# EAGLE design JDM2_2-Voltage_JmpConf_6Pin_New (EAGLE 7.2.0)
JDM2 with selectable Dual-Voltage
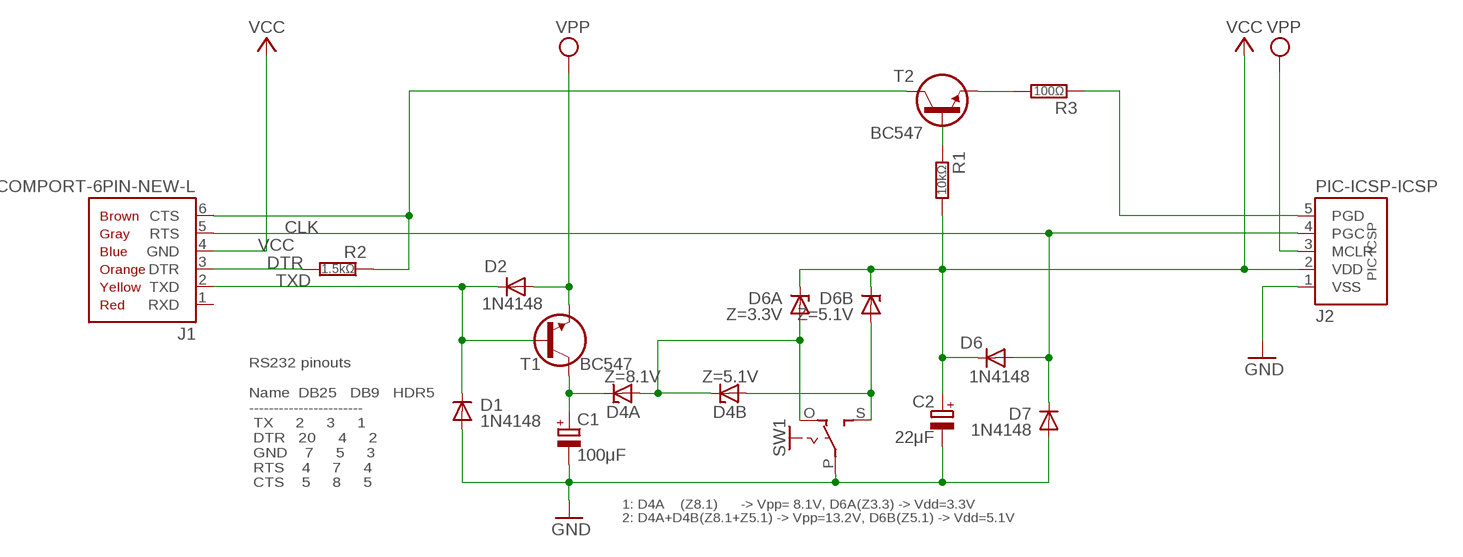
[diagram p0: schematic, sheet 1]

## Parts
C1  100μF  CPOLE2,5-5/V  [E2,5-5/V]
C2  22μF  CPOLE2,5-4/V  [E2.5-4/V]
D1  1N4148  1N414834-5V  [DO34-5V]
D2  1N4148  1N414834-5  [DO34-5]
D4A  Z=8.1V  Z-DIODE34Z5  [DO34Z5]
D4B  Z=5.1V  Z-DIODE34Z5  [DO34Z5]
D6  1N4148  1N414834-5V  [DO34-5V]
D6A  Z=3.3V  Z-DIODE34Z7V  [DO34Z7V]
D6B  Z=5.1V  Z-DIODE34Z7V  [DO34Z7V]
D7  1N4148  1N414834-7V  [DO34-7V]
J1  COMPORT-6PIN-NEW-L  [RS232-6PIN-NEW-L]
J2  PIC-ICSP-ICSP  [PIC-ICSP]
R1  10kΩ  R0202/7-V  [0202/7-V]
R2  1.5kΩ  R0202/7-V  [0202/7-V]
R3  100Ω  R0202/7  [0202/7]
SW1  SL-SW-1P-2T-JPSW  [JPSW-1P2T]
T1  BC547  BC547CBE  [TO92-CBE]
T2  BC547  BC547CBE  [TO92-CBE]

## Nets
/MCLR: D2.A J2.3(MCLR) T1.E ; supply symbol labelled VPP
CLK: D6.A D7.C J1.5(RTS) J2.4(PGC)
CTS: J1.6(CTS) R2.1 T2.C
DATA: R3.2 T2.E
DTR: J1.3(DTR) R2.2
GND: C1.- C2.- D1.A D7.A J2.1(VSS) SW1.P
N$1: R1.1 T2.B
N$3: D4B.A D6B.A SW1.S
N$4: D4A.A D4B.C D6A.A SW1.O
PGD: J2.5(PGD) R3.1
TXD: D1.C D2.C J1.2(TXD) T1.B
VCC: C2.+ D6.C D6A.C D6B.C J1.4(GND) J2.2(VDD) R1.2
VPP: C1.+ D4A.C T1.C
Unconnected: J1.1(RXD)

## Notes on the sheet
- RS232 pinouts
  
  Name  DB25   DB9   HDR5
  -----------------------
   TX     2     3     1
   DTR   20     4     2
   GND    7     5     3
   RTS    4     7     4
   CTS    5     8     5
- 1: D4A    (Z8.1)      -> Vpp= 8.1V, D6A(Z3.3) -> Vdd=3.3V
  2: D4A+D4B(Z8.1+Z5.1) -> Vpp=13.2V, D6B(Z5.1) -> Vdd=5.1V

## Library data of the parts
C1 C2 = c:CPOL: POLARIZED CAPACITOR, European symbol
D1 D2 D6 D7 = d:1N4148
D4A D4B D6A D6B = d:Z-DIODE
J1 = pinconn:COMPORT-6PIN-NEW
J2 = pinconn:PIC-ICSP
R1-R3 = r:R: RESISTOR, European symbol
SW1 = sw:SL-SW-1P-2T
T1 T2 = t:BC547

## Net classes
0 default: width 0.559 mm
1 power: width 0.559 mm

## Board
JDM2 with selectable Dual-Voltage
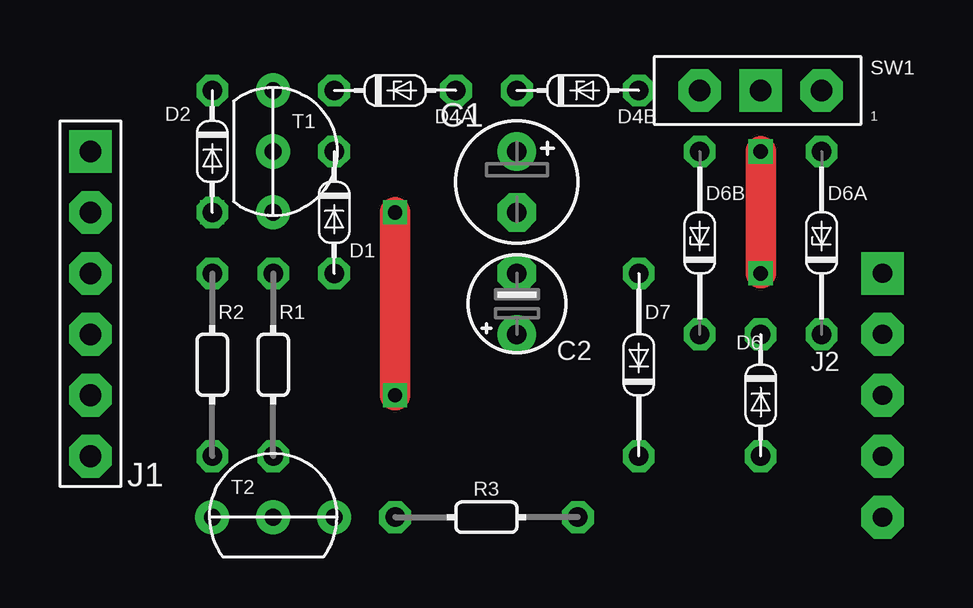
[diagram p1: board, top side]
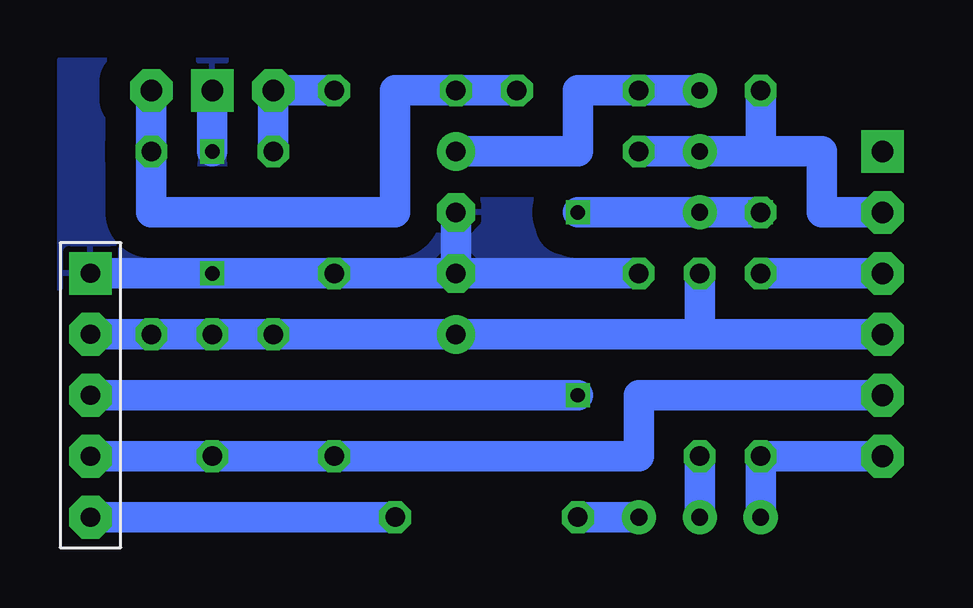
[diagram p2: board, bottom side, seen from below]

No outline drawn. Coordinates in mm, seen from the top.
Copper layers (1*16): Top 0.035mm / dielectric 1.5mm / Bottom 0.035mm
Design rules "default": minimum track width 10mil, minimum drill 24mil, track to track 8mil, track to pad 8mil, pad to pad 8mil, via to via 8mil, smd to smd 8mil, copper to edge 40mil, drill to drill 8mil, minimum pad ring 10mil, minimum via ring 8mil, stop-mask expansion 4mil, vias tented up to drill 0mil, thermal gap 10mil

### Footprints (pad centres in the part's own frame; a part is rotated, then mirrored left to right if it is on the bottom)
E2,5-5/V = drill 0.813 pad 1.6: + 0,2.54 | drill 0.813 pad 1.6 octagon: - 0,0
E2.5-4/V = drill 0.813 pad 1.6: + 0,2.54 | drill 0.813 pad 1.6 octagon: - 0,0
DO34-5V = drill 0.813 octagon: A 0,2.54; C 0,-2.54
DO34-5 = drill 0.813 octagon: A 2.54,0; C -2.54,0
DO34Z5 = drill 0.813 octagon: A -2.54,0; C 2.54,0
DO34Z7V = drill 0.813 octagon: A 0,3.81; C 0,-3.81
DO34-7V = drill 0.813 octagon: A 0,3.81; C 0,-3.81
RS232-6PIN-NEW-L = drill 0.9 pad 1.778 square: 1 0,6.35 | drill 0.9 pad 1.778 octagon: 2 0,3.81; 3 0,1.27; 4 0,-1.27; 5 0,-3.81; 6 0,-6.35
PIC-ICSP = drill 0.8 pad 1.778 square: 1 0,0 | drill 0.8 pad 1.778 octagon: 2 2.54,0; 3 5.08,0; 4 7.62,0; 5 10.16,0
0202/7-V = drill 0.813 octagon: 1 0,-3.81; 2 0,3.81
0202/7 = drill 0.813 octagon: 1 -3.81,0; 2 3.81,0
JPSW-1P2T = drill 0.9 pad 1.778 octagon: O -2.54,0; S 2.54,0 | drill 0.9 pad 1.778 square: P 0,0
TO92-CBE = drill 0.7 pad 1.422: B 0,0; C 0,2.54; E 0,-2.54

### Placement (x,y rotation side)
C1  19.05,13.97 0 top
C2  19.05,11.43 180 top
D1  11.43,13.97 180 top
D2  6.35,16.51 270 top
D4A  13.97,19.05 180 top
D4B  21.59,19.05 180 top
D6  29.21,6.35 180 top
D6A  31.75,12.7 0 top
D6B  26.67,12.7 0 top
D7  24.13,7.62 0 top
J1  1.27,10.16 0 top
J2  34.29,11.43 270 top
R1  8.89,7.62 0 top
R2  6.35,7.62 0 top
R3  17.78,1.27 180 top
SW1  29.21,19.05 180 top
T1  8.89,16.51 0 top
T2  8.89,1.27 90 top

### Tracks (layer width: path | path; a pad name or v marks a point on that pad's centre or on a via)
/MCLR  (via drill 0.6)
  Top 1.27: v13.97,6.35 v13.97,13.97
  Bottom 1.27: J2.3 v13.97,6.35 | D2.A v13.97,13.97 T1.E
  other vias: 6.35,13.97
CLK
  Bottom 1.27: J2.4 D6.A D7.C 11.43,3.81 11.43,6.35 J1.5
CTS
  Bottom 1.27: T2.C R2.1 J1.6
DATA
  Bottom 1.27: T2.E R3.2
DTR
  Bottom 1.27: J1.3 R2.2
GND  (via drill 0.6)
  Top 1.27: v29.21,11.43 v29.21,16.51
  Bottom 1.27: C2.- D7.A D1.A | C1.- C2.- | C2.- 17.78,11.43 | C2.- v29.21,11.43 J2.1 | v29.21,16.51 SW1.P
  pour Bottom (isolate 1.27): 35.56,0 35.56,20.32 0,20.32 0,0
N$1
  Bottom 1.27: R1.1 T2.B
N$3
  Bottom 1.27: D6B.A SW1.S D4B.A
N$4
  Bottom 1.27: D4A.A D4B.C 21.59,19.05 21.59,13.97 31.75,13.97 D6A.A SW1.O
PGD
  Bottom 1.27: R3.1 J2.5
TXD
  Bottom 1.27: 6.35,16.51 3.81,16.51 3.81,13.97 J1.2 | D2.C 6.35,16.51 | 10.16,16.51 D1.C T1.B 6.35,16.51
VCC
  Bottom 1.27: 8.89,8.89 C2.+ D6.C D6B.C D6A.C J2.2 | 8.89,8.89 R1.2 | J1.4 8.89,8.89
VPP
  Bottom 1.27: T1.C D4A.C 13.97,19.05 13.97,16.51 C1.+

### Text on the board
Measures: 8 | 7 | 6 | 5 | 4 | 3 | 2 | 1 | 1 | 2 | 3 | 4 | 5 | 6 | 7 | 8 | 9 | 10 | 11 | 12 | 13 | 14